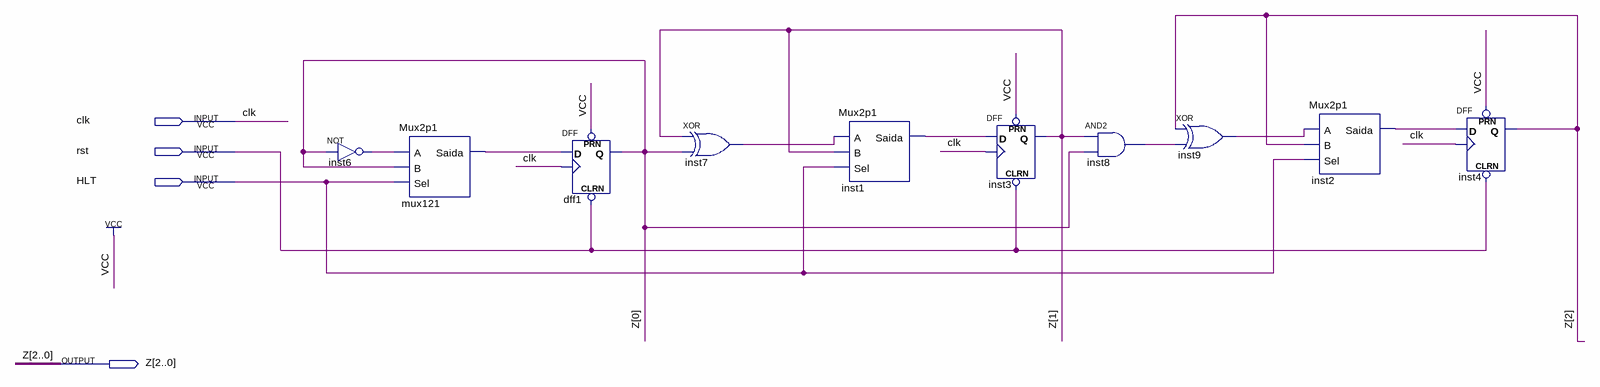
[diagram p0: schematic sheet]
// Quartus schematic Contador_3b.bdf as structural Verilog: 10 symbols, 4 pins
module Contador_3b (
  input  clk,
  input  rst,
  input  HLT,
  output [2:0] Z
);

  wire inst1_saida, inst2_saida, inst6_out, inst7_out, inst8_out, inst9_out, mux121_saida;

  not inst6 (inst6_out, Z[0]);
  Mux2p1 mux121 (.A(inst6_out), .B(Z[0]), .Sel(HLT), .Saida(mux121_saida));
  DFF dff1 (.CLRN(rst), .CLK(clk), .D(mux121_saida), .PRN(1'b1), .Q(Z[0]));
  xor inst7 (inst7_out, Z[1], Z[0]);
  Mux2p1 inst1 (.A(inst7_out), .B(Z[1]), .Sel(HLT), .Saida(inst1_saida));
  DFF inst3 (.CLRN(rst), .CLK(clk), .D(inst1_saida), .PRN(1'b1), .Q(Z[1]));
  and inst8 (inst8_out, Z[1], Z[0]);
  xor inst9 (inst9_out, Z[2], inst8_out);
  Mux2p1 inst2 (.A(inst9_out), .B(Z[2]), .Sel(HLT), .Saida(inst2_saida));
  DFF inst4 (.CLRN(rst), .CLK(clk), .D(inst2_saida), .PRN(1'b1), .Q(Z[2]));
endmodule
